# Altium schematic sheet Konektori_SCH.SchDoc: J_Tag_Programator
size A; CheckedBy: Lazar Nikolovski; Author: Lazar Nikolovski; CompanyName: Herran Innovation Ltd.; DrawnBy: Lazar Nikolovski; Engineer: Lazar Nikolovski; DocumentNumber: 2
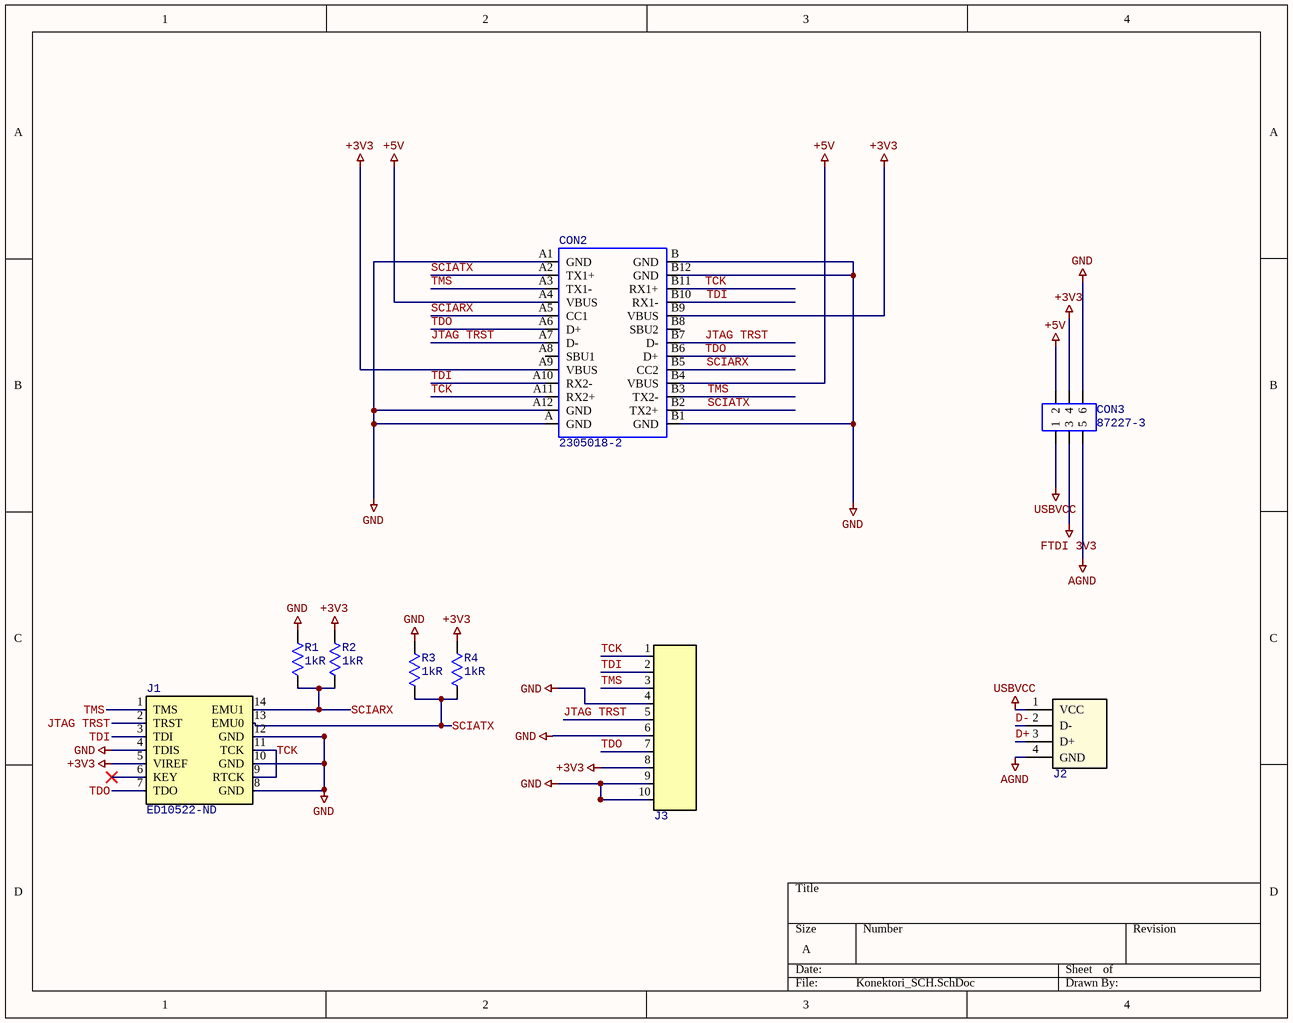
[diagram p0: Konektori_SCH.SchDoc]

## Parts
CON2  2305018-2  [2305018-2]
CON3  87227-3  [87227-3]
J1  ED10522-ND  [14_DIP_JTAG]
J2  USB-B1HSB6  [CON_RCPT_USB-B1HSB6]  (value not drawn)
J3  8-215079-0  [CON_BTB_F_8-215079-0]  (value not drawn)
R1  Resistance: 1kR  [SMD_0603_RES]  (hidden comment: RC0603FR-071KL)
R2  Resistance: 1kR  [SMD_0603_RES]  (hidden comment: RC0603FR-071KL)
R3  Resistance: 1kR  [SMD_0603_RES]  (hidden comment: RC0603FR-071KL)
R4  Resistance: 1kR  [SMD_0603_RES]  (hidden comment: RC0603FR-071KL)

## Nets
+3V3: CON2.A9(VBUS) CON2.B9(VBUS) CON3.4 J1.5(VIREF) J3.8 R2.2 R4.2
+5V: CON2.A4(VBUS) CON2.B4(VBUS) CON3.2
AGND: CON3.5 J2.4(GND)
FTDI 3V3: CON3.3
GND: CON2.A(GND) CON2.A1(GND) CON2.A12(GND) CON2.B(GND) CON2.B1(GND) CON2.B12(GND) CON3.6 J1.4(TDIS) J1.8(GND) J1.10(GND) J1.12(GND) J3.4 J3.6 J3.9 J3.10 R1.2 R3.2
USBVCC: CON3.1 J2.1(VCC)
D+: J2.3(D+)
D-: J2.2(D-)
JTAG TRST: CON2.A7(D-) CON2.B7(D-) J1.2(TRST) J3.5
SCIARX: CON2.A5(CC1) CON2.B5(CC2) J1.14(EMU1) R1.1 R2.1
SCIATX: CON2.A2(TX1+) CON2.B2(TX2+) J1.13(EMU0) R3.1 R4.1
TCK: CON2.A11(RX2+) CON2.B11(RX1+) J1.9(RTCK) J1.11(TCK) J3.1
TDI: CON2.A10(RX2-) CON2.B10(RX1-) J1.3(TDI) J3.2
TDO: CON2.A6(D+) CON2.B6(D+) J1.7(TDO) J3.7
TMS: CON2.A3(TX1-) CON2.B3(TX2-) J1.1(TMS) J3.3

Not connected (* = marked no-connect by the designer): CON2 A8(SBU1) B8(SBU2); J1 6(KEY)*

## Library data of the parts
CON2 = 2305018-2: USB C konektor; Supplier 1: Digi-Key; Supplier Part Number 1: A132569DKR-ND
CON3 = 87227-3: Heder, 3x2, M; Supplier 1: Digi-Key; Supplier Part Number 1: A26569-ND
J1 = CONN_JTAG_Boxheader 14-pol: CONN HEADER VERT 14POS 2.54MM; Manufacturer: On-Shore Technology; Manufacturer Part Number: 302-S141; Connector Type: Male Pin; Number of Positions: 14; Pitch: 0.1inch; Supplier 1: Digi-Key; RoHS: Yes; Category: Connectors; Stock 1: 34434; Pricing 1: 1=0,32000, 10=0,27400, 200=0,21280, 600=0,18240, 1000=0,15200, 5000=0,13029, 10000=0,12160 (USD); Mount: Through Hole; Color: Black; Contact Plating: Gold; Number of Rows: 2; Packaging: Tray; Termination: Solder; Row Spacing: 0.1inch; ComponentLink1URL: https://datasheet.ciiva.com/742/302-sxxx-742188.pdf?src-supplier=Digi-Key; ComponentLink1Description: https://datasheet.ciiva.com/742/302-sxxx-742188.pdf?src-supplier=Digi-Key; Supplier Part Number 1: ED10522-ND
J2 = CON_RCTB_USB-B1HSB6: CONN RCPT TYPEB 4POS R/A; Manufacturer: On-Shore Technology; Connector Type: USB; Number of Contacts: 4; Gender: Receptacle; Supplier 1: Digi-Key; Manufacturer Part Number: USB-B1HSB6; RoHS: Yes; Category: Connectors; Stock 1: 7174; Pricing 1: 1=0,61000, 10=0,53300, 25=0,48720, 40=0,45875, 117=0,43957, 234=0,40132, 468=0,38220, 1053=0,31532, 2457=0,28665 (USD); Mount: Through Hole,Horizontal; Package Quantity: 50; Packaging: Tray; ComponentLink1URL: https://datasheet.ciiva.com/851/usb-b1hsxx-851167.pdf?src-supplier=Digi-Key; ComponentLink1Description: https://datasheet.ciiva.com/851/usb-b1hsxx-851167.pdf?src-supplier=Digi-Key; Supplier Part Number 1: ED2983-ND
J3 = CON_BTB_F_8-215079-0: CONN FMALE-ON-BRD 10POS VERT T/H; Manufacturer: TE Connectivity; Contact Resistance: 10mR; Connector Type: Receptacle,Connector,Pin; Number of Positions: 10; Insulation Resistance: 1GR; Board Standoff: No (Without); Connector System: Board-to-Board; PCB Mount Retention: With; PCB Mounting Orientation: Vertical; Shrouded: Yes (With); Contact Current Rating: 1.5A; Gender: Receptacle; Voltage Rating: 230V; Working Voltage: 100V; Pitch: 0.05inch; Row Spacing: 0.1inch; Plating Thickness: 0.005um; Contact Post Length: 0.122inch; Supplier 1: Digi-Key; Manufacturer Part Number: 8-215079-0; RoHS: Yes; Category: Headers and Wire Housings; Stock 1: 3227; Pricing 1: 1=1.51000, 10=1.37400, 100=1.17800 (USD); Mount: Through Hole; Number of Pins: 10; Contact Plating: Tin; Contact Material: Bronze; Color: Red; Housing Color: Red; Housing Material: Polyester; Insulation Material: PBT; Insulation Color: Red; Min Operating Temperature: -40°C; Max Operating Temperature: 105°C; Number of Rows: 2; Packaging: Box; Package Quantity: 250; Termination: Through Hole; Number of Contacts: 10; Orientation: Straight; Mating Alignment: No (Without); Mating Retention: No (Without); PCB Mount Alignment: No (Without); Current Rating: 1.5A; Fastening Type: Push,Pull; Voltage Rating (DC): 100V; Length: 14.7mm; Width: 14.7mm; Height: 0.16inch; Depth: 5.1mm; Radiation Hardening: No; ELV: Compliant; Flammability Rating: UL94 V-0; REACH SVHC: No SVHC; ComponentLink1URL: https://datasheet.ciiva.com/11745/0900766b8101108b-11745837.pdf?src-supplier=RSComponents; ComponentLink1Description: https://datasheet.ciiva.com/11745/0900766b8101108b-11745837.pdf?src-supplier=RSComponents; ComponentLink2URL: https://datasheet.ciiva.com/5723/493968-5723952.pdf?src-supplier=Farnell; ComponentLink2Description: https://datasheet.ciiva.com/5723/493968-5723952.pdf?src-supplier=Farnell; ComponentLink3URL: https://datasheet.ciiva.com/25908/eng-cs-82012-ribbon-cable-interconnect-sol-0412-25908056.pdf?src-supplier=Avnet+Europe; ComponentLink3Description: https://datasheet.ciiva.com/25908/eng-cs-82012-ribbon-cable-interconnect-sol-0412-25908056.pdf?src-supplier=Avnet+Europe; ComponentLink4URL: https://datasheet.ciiva.com/30057/eng-cat-889409-0699-96-30057720.pdf?src-supplier=Onlinecomponents.com; ComponentLink4Description: https://datasheet.ciiva.com/30057/eng-cat-889409-0699-96-30057720.pdf?src-supplier=Onlinecomponents.com; ComponentLink5URL: https://datasheet.ciiva.com/754/eng-cd-215079-y-754233.pdf?src-supplier=Digi-Key; ComponentLink5Description: https://datasheet.ciiva.com/754/eng-cd-215079-y-754233.pdf?src-supplier=Digi-Key; ComponentLink6URL: https://datasheet.ciiva.com/14156/mo215079-128482-90-dat-en-14156698.pdf?src-supplier=Distrelec; ComponentLink6Description: https://datasheet.ciiva.com/14156/mo215079-128482-90-dat-en-14156698.pdf?src-supplier=Distrelec; ComponentLink7URL: https://datasheet.ciiva.com/754/eng-cd-215079-y-754187.pdf?src-supplier=Digi-Key; ComponentLink7Description: https://datasheet.ciiva.com/754/eng-cd-215079-y-754187.pdf?src-supplier=Digi-Key; ComponentLink8URL: https://datasheet.ciiva.com/43491/747833-da-01-en-federleiste-gerade-10pol-43491941.pdf?src-supplier=Conrad; ComponentLink8Description: https://datasheet.ciiva.com/43491/747833-da-01-en-federleiste-gerade-10pol-43491941.pdf?src-supplier=Conrad; Supplier Part Number 1: A99470CT-ND
R1-R4 = RES_0603_1K_1%_1/10W: RES SMD 1K OHM 1% 1/10W 0603; Manufacturer: Yageo; Temperature Coefficient: 100ppm/°C; Power Rating: 100mW; Voltage Rating: 50V; Supplier 1: Digi-Key; Manufacturer Part Number: RC0603FR-071KL; RoHS: Yes; Category: Chip SMD Resistors; Stock 1: 24609199; Pricing 1: 1=0.10000, 10=0.02300, 100=0.00930, 1000=0.00417, 2500=0.00362 (USD); Case/Package: 0603; Contact Plating: Tin,Matte; Case Code (Imperial): 0603; Case Code (Metric): 1608; Size Code: 0603; Min Operating Temperature: -55°C; Max Operating Temperature: 155°C; Tolerance: 1%; Packaging: Tape and Reel; Resistor Type: Thick Film; Termination: SMD/SMT; Features: Moisture Resistant; Series: RC; Max Power Dissipation: 100mW; Number of Terminations: 2; Resistance Tolerance: 1%; Construction: Rectangular; Technology: THICK FILM; Length: 1.6mm; Height: 0.45mm; Depth: 0.8mm; Radiation Hardening: No; REACH SVHC: No SVHC; Lead Free: Lead Free; Military Standard: Not; RoHS Compliant: Yes; ComponentLink1URL: https://datasheet.ciiva.com/11808/0900766b80f96399-11808081.pdf?src-supplier=RSComponents; ComponentLink1Description: https://datasheet.ciiva.com/11808/0900766b80f96399-11808081.pdf?src-supplier=RSComponents; ComponentLink2URL: https://datasheet.ciiva.com/25906/pyu-rc0603-51-rohs-l-4-25906933.pdf?src-supplier=Avnet+Europe; ComponentLink2Description: https://datasheet.ciiva.com/25906/pyu-rc0603-51-rohs-l-4-25906933.pdf?src-supplier=Avnet+Europe; ComponentLink3URL: https://datasheet.ciiva.com/7660/1868787-7660790.pdf?src-supplier=Element14; ComponentLink3Description: https://datasheet.ciiva.com/7660/1868787-7660790.pdf?src-supplier=Element14; ComponentLink4URL: https://datasheet.ciiva.com/7746/1738695-7746279.pdf?src-supplier=Element14; ComponentLink4Description: https://datasheet.ciiva.com/7746/1738695-7746279.pdf?src-supplier=Element14; ComponentLink5URL: https://datasheet.ciiva.com/7746/1686128-7746280.pdf?src-supplier=Element14; ComponentLink5Description: https://datasheet.ciiva.com/7746/1686128-7746280.pdf?src-supplier=Element14; ComponentLink6URL: https://datasheet.ciiva.com/28386/pyu-rc0603-51-rohs-l-4-28386648.pdf?src-supplier=Avnet+Europe; ComponentLink6Description: https://datasheet.ciiva.com/28386/pyu-rc0603-51-rohs-l-4-28386648.pdf?src-supplier=Avnet+Europe; ComponentLink7URL: https://datasheet.ciiva.com/7746/1738695-7746281.pdf?src-supplier=Element14; ComponentLink7Description: https://datasheet.ciiva.com/7746/1738695-7746281.pdf?src-supplier=Element14; ComponentLink8URL: https://datasheet.ciiva.com/8896/pyu-rc0603-51-rohs-l-4-8896106.pdf?src-supplier=Avnet; ComponentLink8Description: https://datasheet.ciiva.com/8896/pyu-rc0603-51-rohs-l-4-8896106.pdf?src-supplier=Avnet; ComponentLink9URL: https://datasheet.ciiva.com/15189/getdatasheetpartid-404327-15189644.pdf?src-supplier=Verical; ComponentLink9Description: https://datasheet.ciiva.com/15189/getdatasheetpartid-404327-15189644.pdf?src-supplier=Verical; ComponentLink10URL: https://datasheet.ciiva.com/7983/443971-7983613.pdf?src-supplier=Element14; ComponentLink10Description: https://datasheet.ciiva.com/7983/443971-7983613.pdf?src-supplier=Element14; Supplier Part Number 1: 311-1.00KHRCT-ND